# Altium schematic sheet NBModule.SchDoc: NB-IoT Module M5311
size A4; Author: Siqing Ma; Revision: 1.0; SheetNumber: 1
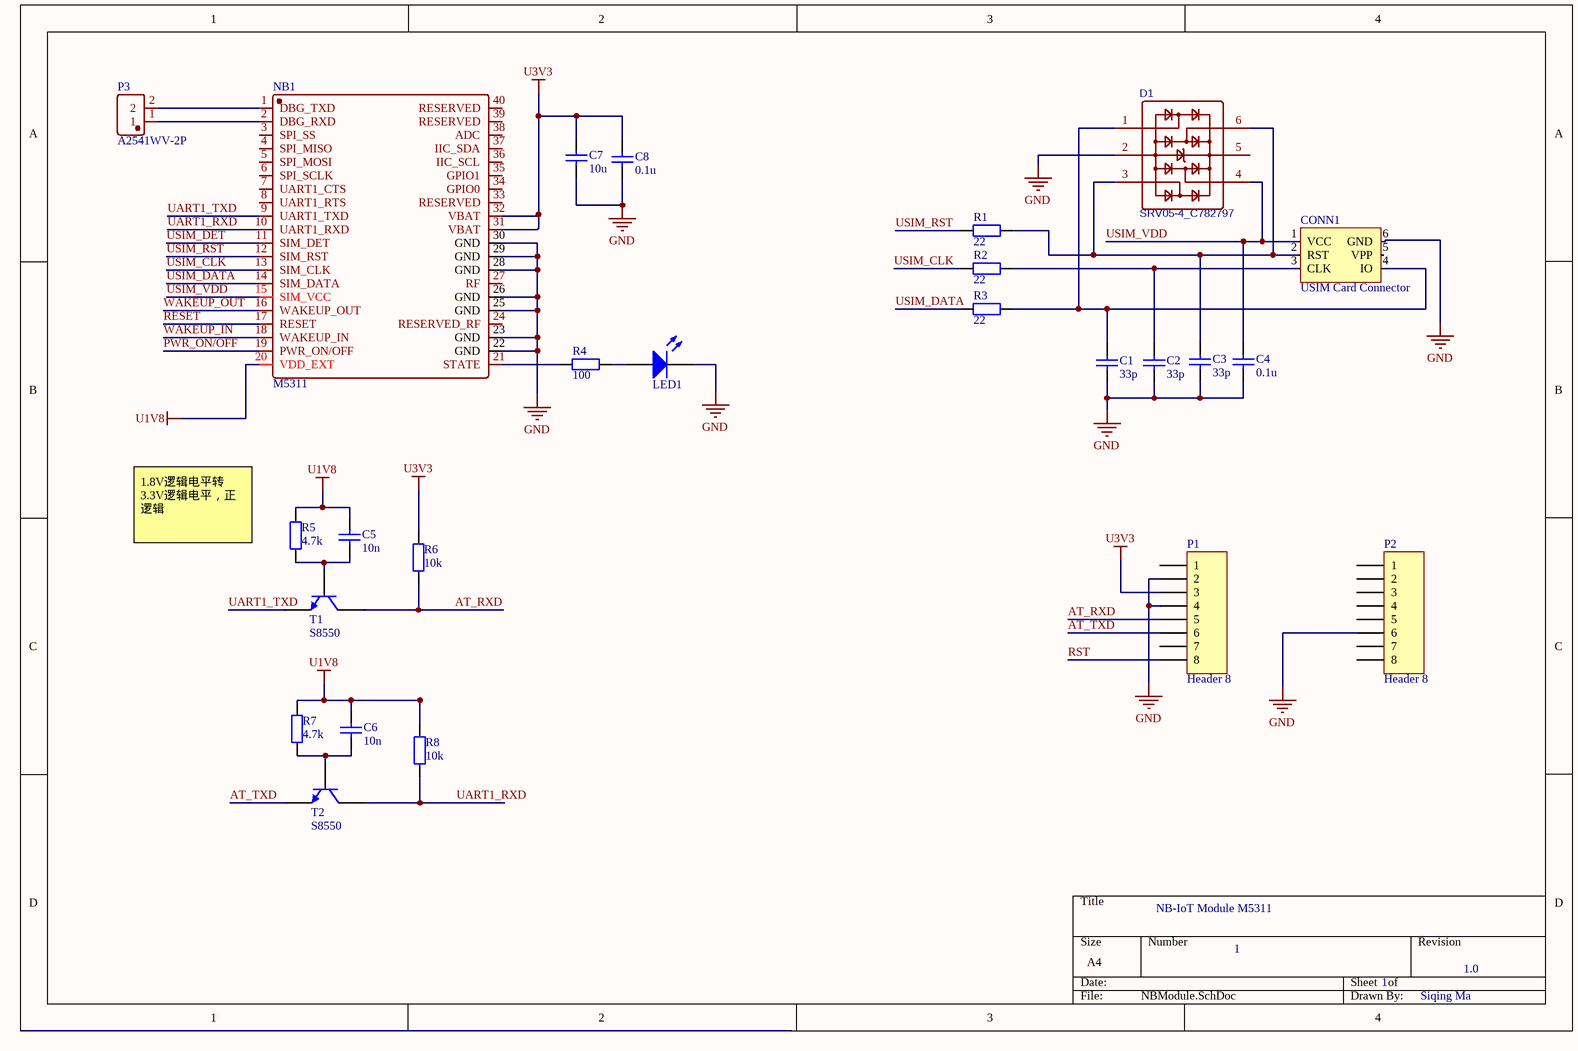
[diagram p0: NBModule.SchDoc]

## Parts
C1  33p  [C 1206]
C2  33p  [C 1206]
C3  33p  [C 1206]
C4  0.1u  [C 1206]
C5  10n  [C 1206]
C6  10n  [C 1206]
C7  10u  [C 1206]
C8  0.1u  [C 1206]
CONN1  USIM Card Connector  [SIM-SMD_SMO-1512]
D1  SRV05-4_C782797  [SOT-23-6_L2.9-W1.6-P0.95-LS2.8-BR]
LED1  LED Chip  [LED 1206R]  (value not drawn)
NB1  M5311  [M5311]
P1  Header 8  [HDR1X8]
P2  Header 8  [HDR1X8]
P3  A2541WV-2P  [HDR-TH_P2.54-H-M_A2541WV-2P]
R1  22  [R 0805]
R2  22  [R 0805]
R3  22  [R 0805]
R4  100  [R 0805]
R5  4.7k  [R 0805]
R6  10k  [R 0805]
R7  4.7k  [R 0805]
R8  10k  [R 0805]
T1  S8550  [SOT-23B_N]
T2  S8550  [SOT-23B_N]

## Nets
GND: C1.1 C2.1 C3.1 C4.1 C7.1 C8.1 CONN1.6(GND) D1.2 LED1.2(K) NB1.22(GND) NB1.23(GND) NB1.25(GND) NB1.26(GND) NB1.28(GND) NB1.29(GND) NB1.30(GND) P1.2 P1.4 P2.6
U1V8: C5.1 C6.1 NB1.20(VDD_EXT) R5.1 R7.1 R8.1
U3V3: C7.2 C8.2 NB1.31(VBAT) NB1.32(VBAT) P1.3 R6.1
AT_RXD: P1.5 R6.2 T1.1(C)
AT_TXD: P1.6 T2.3(E)
PWR_ON/OFF: NB1.19(PWR_ON/OFF)
RESET: NB1.17(RESET)
RST: P1.8
UART1_RXD: NB1.10(UART1_RXD) R8.2 T2.1(C)
UART1_TXD: NB1.9(UART1_TXD) T1.3(E)
USIM_CLK: NB1.13(SIM_CLK) R2.2
USIM_DATA: NB1.14(SIM_DATA) R3.2
USIM_DET: NB1.11(SIM_DET)
USIM_RST: NB1.12(SIM_RST) R1.2
USIM_VDD: C4.2 CONN1.1(VCC) D1.4 NB1.15(SIM_VCC)
WAKEUP_IN: NB1.18(WAKEUP_IN)
WAKEUP_OUT: NB1.16(WAKEUP_OUT)
NetC1_2: C1.2 CONN1.4(IO) D1.1 R3.1
NetC2_2: C2.2 CONN1.3(CLK) R2.1
NetC3_2: C3.2 CONN1.2(RST) D1.3 D1.6 R1.1
NetC5_2: C5.2 R5.2 T1.2(B)
NetC6_2: C6.2 R7.2 T2.2(B)
NetLED1_1: LED1.1(A) R4.1
NetNB1_1: NB1.1(DBG_TXD) P3.2
NetNB1_2: NB1.2(DBG_RXD) P3.1
NetNB1_21: NB1.21(STATE) R4.2

Not connected (* = marked no-connect by the designer): CONN1 5(VPP); D1 5; NB1 3(SPI_SS) 4(SPI_MISO) 5(SPI_MOSI) 6(SPI_SCLK) 7(UART1_CTS) 8(UART1_RTS) 24(RESERVED_RF) 27(RF) 33(RESERVED) 34(GPIO0) 35(GPIO1) 36(IIC_SCL) 37(IIC_SDA) 38(ADC) 39(RESERVED) 40(RESERVED); P1 1 7; P2 1 2 3 4 5 7 8

## Notes on the sheet
- (near R5) 1.8V逻辑电平转3.3V逻辑电平，正逻辑

## Library data of the parts
C1-C8 = Cap_1206: 1206贴片电容; Value: 104; Package: 0805; 常见贴片电容尺寸图: https://wenku.baidu.com/view/21d5206100f69e3143323968011ca300a6c3f6b2.html
D1 = SRV05-4_C782797: BOM_Manufacturer: SEMBO; Contributor: LCSC; BOM_Supplier: LCSC; BOM_Supplier Part: C782797; BOM_Manufacturer Part: SRV05-4; spicePre: D; spiceSymbolName: SRV05-4_C782797
LED1 = LED Chip: Typical Chip LED; Published: 8-Jun-2000; Revision: July-2002: Re-released for DXP Platform.; Publisher: Altium Limited
P1 P2 = Header 8: Header, 8-Pin; LatestRevisionDate: 17-Jul-2002; LatestRevisionNote: Re-released for DXP Platform.; Publisher: Altium Limited
R1-R8 = Res_0805: 0805贴片电阻; ComponentLink1Description: 供应商链接; ComponentLink1URL: http://www.szlcsc.com/product/details_26856.html; Package: 0805; Supplier: LC; SuppliersPartNumber: C26113
T1 T2 = QNPN: NPN Bipolar Transistor; Published: 8-Jun-2000; LatestRevisionDate: 29-May-2009; LatestRevisionNote: IPC-7351 Footprint Added.; PackageVersion: Aug-1999; PackageReference: SOT-23B; Publisher: Altium Limited; PackageDescription: 3-Pin SOT-23 Package 0.95 mm Pitch, 2.4 mm Lead Span